# EAGLE design stm32 bord (EAGLE 9.1.0)
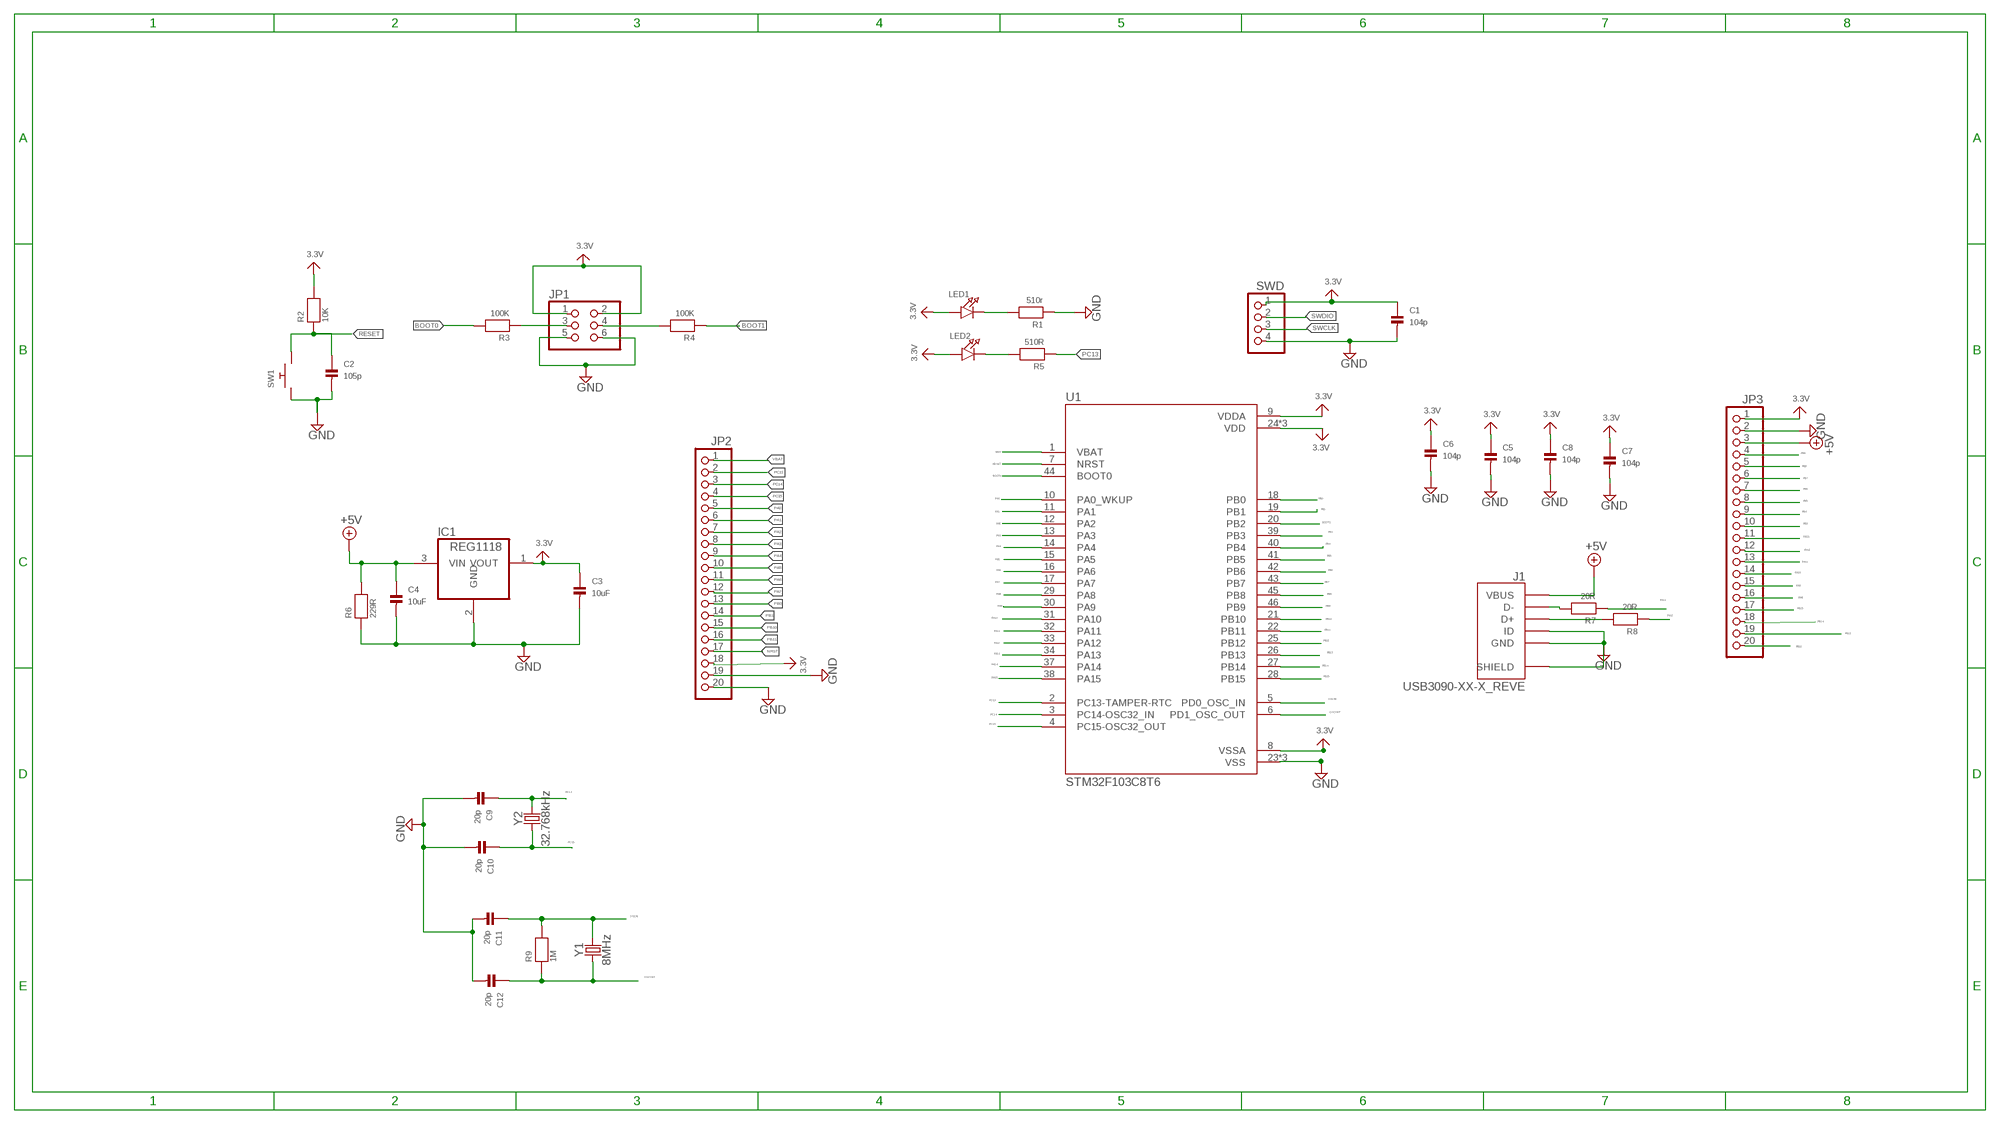
[diagram p0: schematic, sheet 1]

## Parts
C1  104p  CAP_CERAMIC_0603  [_0603]
C2  105p  CAP_CERAMIC_0603  [_0603]
C3  10uF  CAP_CERAMIC_0603  [_0603]
C4  10uF  CAP_CERAMIC_0603  [_0603]
C5  104p  CAP_CERAMIC_0603  [_0603]
C6  104p  CAP_CERAMIC_0603  [_0603]
C7  104p  CAP_CERAMIC_0603  [_0603]
C8  104p  CAP_CERAMIC_0603  [_0603]
C9  20p  CAP_CERAMIC_0603  [_0603]
C10  20p  CAP_CERAMIC_0603  [_0603]
C11  20p  CAP_CERAMIC_0603  [_0603]
C12  20p  CAP_CERAMIC_0603  [_0603]
IC1  REG1118  [SOT223]
J1  USB3090-XX-X_REVE  [GCT_USB3090-XX-X_REVE]
JP1  PINHD-2X3  [2X03]
JP2  PINHD-1X20  [1X20]
JP3  PINHD-1X20  [1X20]
LED1  LED0603  [CHIPLED_0603]
LED2  LED0603  [CHIPLED_0603]
R1  510r  RESISTOR0603  [0603]
R2  10K  RESISTOR0603  [0603]
R3  100K  RESISTOR0603  [0603]
R4  100K  RESISTOR0603  [0603]
R5  510R  RESISTOR0603  [0603]
R6  229R  RESISTOR0603  [0603]
R7  20R  RESISTOR0603  [0603]
R8  20R  RESISTOR0603  [0603]
R9  1M  RESISTOR0603  [0603]
SW1  SWITCH_PUSHBUTTONSOFTTOUCHSMD_SJ  [PUSHBUTTON_SMD_SJ]
SWD  PINHD-1X4  [1X04]
U1  STM32F103C8T6  [QFP50P900X900X160-48N]
Y1  8MHz  CRYSTAL-32.768KHZSMD-2X6  [CRYSTAL-SMD-2X6-CYL]
Y2  32.768kHz  CRYSTAL-32.768KHZSMD-2X6  [CRYSTAL-SMD-2X6-CYL]

## Nets
3.3V: C1.1 C3.1 C5.1 C6.1 C7.1 C8.1 IC1.1(VOUT) JP1.1 JP1.2 JP2.18 JP3.1 LED1.A LED2.A R2.2 SWD.1 U1.8(VSSA) U1.9(VDDA) U1.24(VDD) U1.36(VDD) U1.48(VDD)
+5V: C4.1 IC1.3(VIN) J1.1(VBUS) JP3.3 R6.2
BOOT0: R3.2 U1.44(BOOT0)
BOOT1: R4.1 U1.20(PB2)
GND: C1.2 C2.2 C3.2 C4.2 C5.2 C6.2 C7.2 C8.2 C9.2 C10.2 C11.2 C12.2 IC1.2(GND) J1.4(ID) J1.5(GND) J1.6(SHIELD) J1.7(SHIELD) J1.8(SHIELD) J1.9(SHIELD) JP1.5 JP1.6 JP2.19 JP2.20 JP3.2 R1.1 R6.1 SW1.P$1 SWD.4 U1.23(VSS) U1.35(VSS) U1.47(VSS)
N$1: JP1.3 R3.1
N$2: JP1.4 R4.2
N$3: LED1.C R1.2
N$4: LED2.C R5.2
N$7: J1.2(D-) R7.2
N$8: J1.3(D+) R8.2
NRST: JP2.17
OSCIN: C11.1 R9.2 U1.5(PD0_OSC_IN) Y1.X2
OSCOUT: C12.1 R9.1 U1.6(PD1_OSC_OUT) Y1.X1
PA0: JP2.5 U1.10(PA0_WKUP)
PA1: JP2.6 U1.11(PA1)
PA2: JP2.7 U1.12(PA2)
PA3: JP2.8 U1.13(PA3)
PA4: JP2.9 U1.14(PA4)
PA5: JP2.10 U1.15(PA5)
PA6: JP2.11 U1.16(PA6)
PA7: JP2.12 U1.17(PA7)
PA8: JP3.16 U1.29(PA8)
PA9: JP3.15 U1.30(PA9)
PA10: JP3.14 U1.31(PA10)
PA11: JP3.13 R7.1 U1.32(PA11)
PA12: JP3.12 R8.1 U1.33(PA12)
PA13: U1.34(PA13)
PA14: U1.37(PA14)
PA15: JP3.11 U1.38(PA15)
PB0: JP2.13 U1.18(PB0)
PB1: JP2.14 U1.19(PB1)
PB3: JP3.10 U1.39(PB3)
PB4: JP3.9 U1.40(PB4)
PB5: JP3.8 U1.41(PB5)
PB6: JP3.7 U1.42(PB6)
PB7: JP3.6 U1.43(PB7)
PB8: JP3.5 U1.45(PB8)
PB9: JP3.4 U1.46(PB9)
PB10: JP2.15 U1.21(PB10)
PB11: JP2.16 U1.22(PB11)
PB12: JP3.20 U1.25(PB12)
PB13: JP3.19 U1.26(PB13)
PB14: JP3.18 U1.27(PB14)
PB15: JP3.17 U1.28(PB15)
PC13: JP2.2 R5.1 U1.2(PC13-TAMPER-RTC)
PC14: C9.1 JP2.3 U1.3(PC14-OSC32_IN) Y2.X2
PC15: C10.1 JP2.4 U1.4(PC15-OSC32_OUT) Y2.X1
RESET: C2.1 R2.1 SW1.P$2 U1.7(NRST)
SWCLK: SWD.3
SWDIO: SWD.2
VBAT: JP2.1 U1.1(VBAT)

## Library data of the parts
C1-C12 = microbuilder:CAP_CERAMIC: Ceramic Capacitors 0402 - 0402 Surface Mount Capacitors 16pF 50V 5% [Digikey: 445-4899-2-ND] 18pF 50V 5% [Digikey: 490-1281-2-ND] 22pF 50V 5% [Digikey: 490-1283-2-ND] 68pF 50V 5% [Digikey: 490-1289-2-ND] 0.1uF 10V 10% [Digikey: 490-1318-2-ND] 1.0uF 6.3V 10% [Digikey: 490-1320-2-ND] 0603 - 0603 Surface Mount Capacitors 16 pF 50V 5% [Digikey: 445-5051-2-ND] 22 pF 50V [Digikey: PCC220ACVTR-ND] 33 pF 50V 5% [Digikey: 490-1415-1-ND] 56pF 50V 5% [Digikey: 490-1421-1-ND] 220pF 50V 5% [Digikey: 445-1285-1-ND] 680 pF 50V 2200 pF 50V 5% C0G [Digikey: 445-1297-1-ND] 5600 pF 100V 5% X7R [Digikey: 478-3711-1-ND] 0.1 µF 25V 10% [Digikey: PCC2277TR-ND] 0.22 µF 16V 10% X7R [Digikey: 445-1318-1-ND] 1.0 µF 25V 10% [Digikey: 445-5146-2-ND] 0603 - RF Specific 3pF 250V +/-0.1pF RF [Digikey: 712-1347-1-ND] 18 pF 250V 5% [Digikey: 478-3505-1-ND or 712-1322-1-ND] 56 pF 250V 5% C0G RF [Digikey: 490-4867-1-ND] 68 pF 250V RF [Digikey: 490-4868-1-ND] 0805 - 0805 Surface Mount Capacitors 220 pF 250V 2% RF Ceramic Capacitor [Digikey: 712-1398-1-ND] 1000 pF 50V 2% NP0 Ceramic Capacitor [Digikey: 478-3760-1-ND] 0.1 µF 25V 10% Ceramic Capacitor [Digikey: PCC1828TR-ND] 1.0 µF 16V 10% Ceramic Capacitor[Digikey: 490-1691-2-ND] 10.0 µF 10V 10% Ceramic Capacitor[Digikey: 709-1228-1-ND] 10.0 uF 16V 10% Ceramic Capacitor [Digikey: 478-5165-2-ND] 47 uF 6.3V 20% Ceramic Capacitor [Digikey: 587-1779-1-ND or 399-5506-1-ND] 1206 - 1206 Surface Mount Capacitors 47uF 10V 20% Ceramic Capacitor [Digikey: 490-5528-1-ND or 399-5508-1-ND or 445-6010-1-ND] 100uF 6.3V -20%, +80% Y5V Ceramic Capacitor (Digikey: 490-4512-1-ND, Mouser: 81-GRM31CF50J107ZE1L)
IC1 = burr-brown:REG1118: 800mA Low Dropout (LDO) Positive Regulator with Current Source and Sink Capability; MPN: REG1118-2.85/2K5G4; OC_FARNELL: unknown; OC_NEWARK: 14M2185
J1 = USB3090-XX-X_REVE:USB3090-XX-X_REVE: Micro USB Receptacle, Type AB, SMT, R/A, Bottom Mount, w/out Peg, w/outer shell stakes Check prices <https://pricing.snapeda.com/parts/USB3090-30-A/Global%20Connector%20Technology/view-part?ref=eda>; AVAILABILITY: In Stock; DESCRIPTION: USB - micro AB USB 2.0 Receptacle Connector 5 Position Surface Mount, Right Angle; Through Hole, 2.35mm profile, 5 Pins, Horizontal, Bottom mount; MF: Global Connector Technology; MP: USB3090-30-A; PACKAGE: None; PRICE: None; PURCHASE-URL: https://pricing.snapeda.com/search/part/USB3090-30-A/?ref=eda
JP1 = pinhead:PINHD-2X3: PIN HEADER
JP2 JP3 = pinhead:PINHD-1X20: PIN HEADER
LED1 LED2 = microbuilder:LED: LED 0603 - 0603 Surface Mount Package 2mA: Green LED - Low Power (3.9mcd, 2ma, 1.7Vf) - Digikey: 475-2709-2-ND Orange LED - Low Power (9.8mcd, 2ma, 1.8Vf) - Digikey: 475-1194-2-ND Red LED - Low Power (5mcd, 2ma, 1.8Vf) - Digikey: 475-1195-2-ND Yellow LED - Low Power (7mcd, 2ma, 1.8Vf) - Digikey: 475-1196-2-ND 5mA: Blue LED - Low Power (17mcd, 5ma, 2.9Vf) - Digikey: LNJ937W8CRACT-ND 0805 - 0805 Surface Mount Package 2mA: Red LED (8.8mcd, 2mA, 1.8Vf, Clear) - Low Power [Digikey: 475-2510-1-ND] Green LED (5mcd, 2mA, 1.8Vf, Clear) - Low Power [Digikey: 475-2730-1-ND] Yellow LED (11.3mcd, 2mA, 1.8Vf, Clear) - Low Power [Digikey: 475-2555-1-ND] 20mA: Red LED (104mcd, 20mA, Diffused) - LS R976 [Digikey: 475-1278-6-ND] Red LED (12mcd, 20mA, 2.0Vf, Clear) - APT2012EC [Digikey: 754-1128-1-ND] Green LED (15mcd, 20mA, 2.2Vf, Clear) - APT2012GC [Digikey: 754-1131-1-ND] Orange LED (160mcd, 20mA, 2.1Vf, Clear) - APT2012SECK [Digikey: 754-1130-1-ND] 1206 - 1206 Surface Mount Package Green LED (26mcd, 20mA, Diffused) - LG N971 [Digikey: 475-1407-6-ND] Red LED (15mcd, 20mA, Diffused) - LH N974 [Digikey: 475-1416-6-ND]
R1-R9 = microbuilder:RESISTOR: Resistors 0402 - 0402 Surface Mount Package 22 Ohm 1% 1/16W [Digikey: 311-22.0LRTR-ND] 33 Ohm 5% 1/16W 1.0K 5% 1/16W 1.5K 5% 1/16W 2.0K 1% 1/16W 10.0K 1% 1/16W [Digikey: 311-10.0KLRTR-ND] 10.0K 5% 1/16W [Digikey: RMCF0402JT10K0TR-ND] 12.1K 1% 1/16W [Digikey: 311-22.0LRTR-ND] 100.0K 5% 1/16W 0603 - 0603 Surface Mount Package 0 Ohm 1/10 Watt 1% Resistor 15 Ohm 1/10 Watt 1% Resistor 33 Ohm 1/10 Watt 1% Resistor 49.9 Ohm 1/10 Watt 1% Resistor 100 Ohm 1/10 Watt 1% Resistor 150 Ohm 1/10 Watt 1% Resistor 240 Ohm 1/10 Watt 1% Resistor 390 Ohm 1/10 Watt 1% Resistor 560 Ohm 1/10 Watt 1% Resistor 680 Ohm 1/10 Watt 1% Resistor 750 Ohm 1/10 Watt 1% Resistor 1.0K Ohm 1/10 Watt 1% Resistor 1.5K Ohm 1/10 Watt 1% Resistor 2.0K Ohm 1/10 Watt 1% Resistor 2.2K Ohm 1/10 Watt 1% Resistor 3.3K Ohm 1/10 Watt 1% Resistor 4.7K Ohm 1/10 Watt 1% Resistor 10.0K Ohm 1/10 Watt 1% Resistor 12.0K Ohm 1/10 Watt 1% Resistor 12.1K Ohm 1/10 Watt 1% Resistor 20.0K Ohm 1/10 Watt 1% Resistor 33.0K Ohm 1/10 Watt 1% Resistor 100.0K Ohm 1/10 Watt 1% Resistor 0805 - 0805 Surface Mount Package 0 Ohm 1/8 Watt 1% Resistor 33 Ohm 1/8 Watt 1% Resistor 100 Ohm 1/8 Watt 1% Resistor 150 Ohm 1/8 Watt 1% Resistor 200 Ohm 1/8 Watt 1% Resistor 240 Ohm 1/8 Watt 1% Resistor 330 Ohm 1/8 Watt 1% Resistor 390 Ohm 1/8 Watt 1% Resistor 470 Ohm 1/8 Watt 1% Resistor 1.0K Ohm 1/8 Watt 1% Resistor 1.5K Ohm 1/8 Watt 1% Resistor 2.0K Ohm 1/8 Watt 1% Resistor 4.7K Ohm 1/8 Watt 1% Resistor 5.1K Ohm 1/8 Watt 1% Resistor 5.6K Ohm 1/8 Watt 1% Resistor 10.0K Ohm 1/8 Watt 1% Resistor 22.0K Ohm 1/8 Watt 1% Resistor 33.0K Ohm 1/8 Watt 1% Resistor 100K Ohm 1/8 Watt 1% Resistor 1206 - 1206 Surface Mount Package 2012 - 2010 Surface Mount Package 0.11 Ohm 1/2 Watt 1% Resistor - Digikey: RHM.11UCT-ND
SW1 = microbuilder:SWITCH_PUSHBUTTON: Buttons SOFTTOUCHSMD_SJ - Soft touch temporary push button (Super Junk Akihabara) Compatible with SKPMANE010 [Mouser: 688-SKPMAN]
SWD = pinhead:PINHD-1X4: PIN HEADER
U1 = STM32F103C8T6 (1):STM32F103C8T6: Mainstream Performance line, ARM Cortex-M3 MCU with 64 Kbytes Flash, 72 MHz CPU, motor control, USB and CAN Check prices <https://pricing.snapeda.com/parts/STM32F103C8T6/STMicroelectronics/view-part?ref=eda>; AVAILABILITY: In Stock; DESCRIPTION: ARM® Cortex®-M3 STM32F1 Microcontroller IC 32-Bit 72MHz 64KB (64K x 8) FLASH 48-LQFP (7x7); MF: STMicroelectronics; MP: STM32F103C8T6; PACKAGE: LQFP-48 STMicroelectronics; PRICE: None; PURCHASE-URL: https://pricing.snapeda.com/search/part/STM32F103C8T6/?ref=eda
Y1 = SparkFun-Clocks:CRYSTAL-32.768KHZ: 32.768kHz Crystal Frequency: 32.768kHz Frequency Stability: ±20ppm Load Capacitance: 12.5pF (PTH-2X6 & SMD-3.2X1.5), 6pF (SMD-2X6) SparkFun Products: SparkFun BigTime Watch Kit <https://www.sparkfun.com/products/11734> SparkFun nRF52832 Breakout <https://www.sparkfun.com/products/13990> SparkFun Real Time Clock Module <https://www.sparkfun.com/products/12708>; PROD_ID: XTAL-07894; VALUE: 32.768kHz
Y2 = SparkFun-Clocks:CRYSTAL-32.768KHZ: 32.768kHz Crystal Frequency: 32.768kHz Frequency Stability: ±20ppm Load Capacitance: 12.5pF (PTH-2X6 & SMD-3.2X1.5), 6pF (SMD-2X6) SparkFun Products: SparkFun BigTime Watch Kit <https://www.sparkfun.com/products/11734> SparkFun nRF52832 Breakout <https://www.sparkfun.com/products/13990> SparkFun Real Time Clock Module <https://www.sparkfun.com/products/12708>; PROD_ID: XTAL-07894

## Net classes
0 default: width 0.254 mm, drill 0.254 mm, clearance 0.203 mm
1 5V: width 0.254 mm, drill 0.254 mm, clearance 0.203 mm
2 3V3: width 0.254 mm, drill 0.254 mm, clearance 0.203 mm

## Board
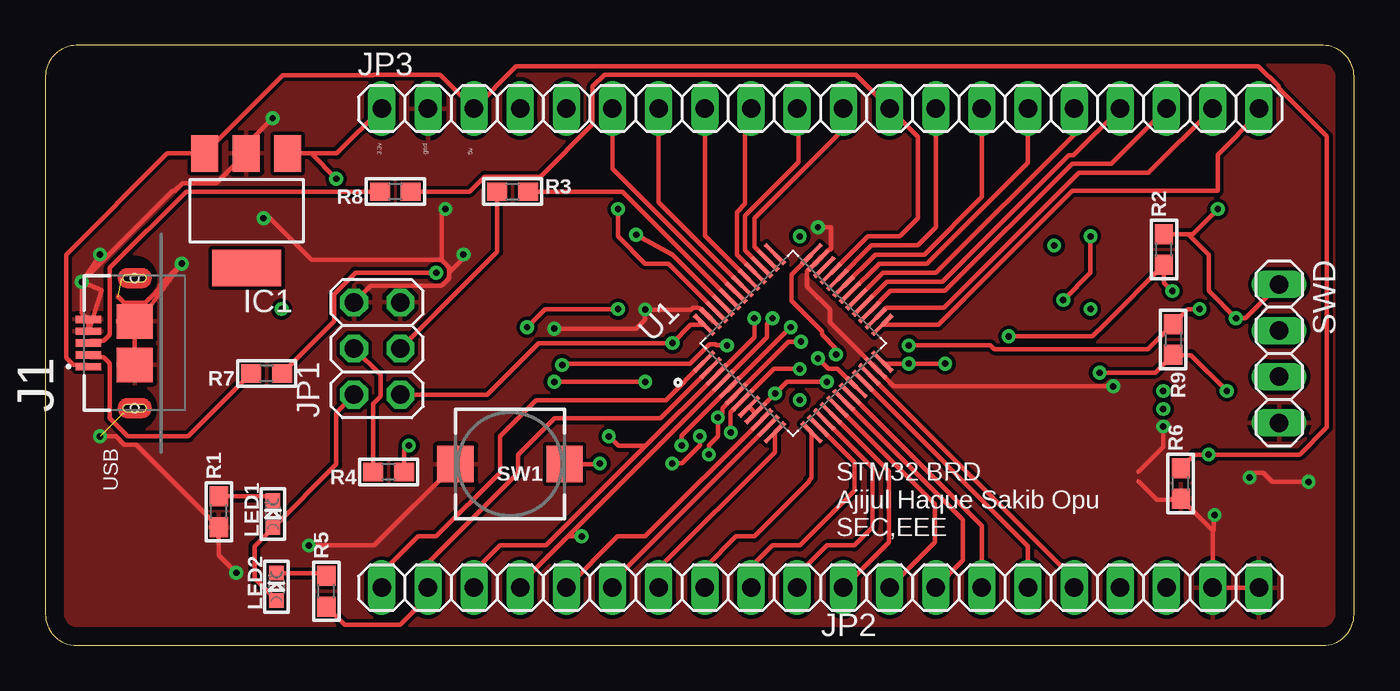
[diagram p1: board, top side]
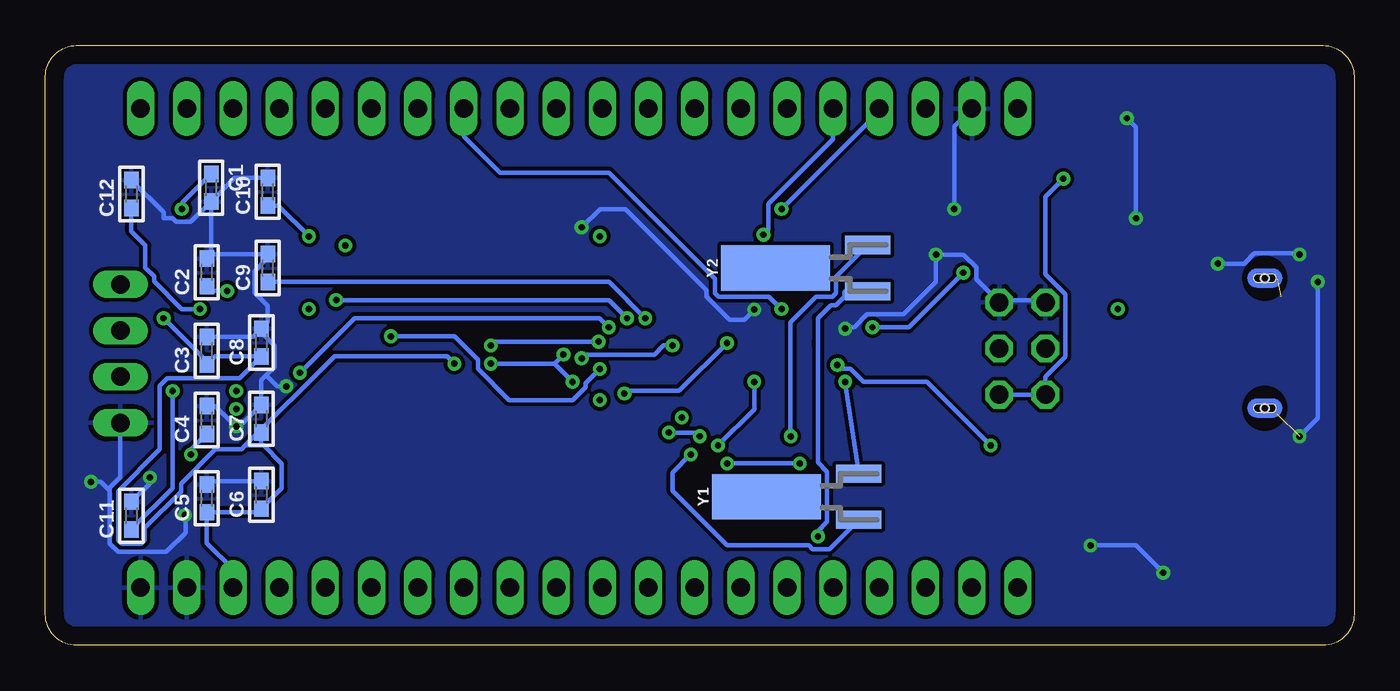
[diagram p2: board, bottom side, seen from below]

Size 72 x 33 mm. Coordinates in mm from the lower left corner, seen from the top.
Outline: 0,31.29 0,1.71 arc90 1.71,0 70.29,0 arc90 72,1.71 72,31.29 arc90 70.29,33 1.71,33 arc90 0,31.29
Copper layers (1*16): Top 0.035mm / dielectric 1.5mm / Bottom 0.035mm
Design rules "default *": minimum track width 6mil, minimum drill 0.35mm, track to track 6mil, track to pad 6mil, pad to pad 6mil, via to via 6mil, smd to smd 6mil, copper to edge 40mil, drill to drill 6mil, minimum pad ring 10mil, minimum via ring 8mil, stop-mask expansion 4mil, vias tented up to drill 0mil, thermal gap 10mil

### Footprints (pad centres in the part's own frame; a part is rotated, then mirrored left to right if it is on the bottom)
_0603 = smd 0.9 x 0.8: 1 -0.762,0; 2 0.762,0
SOT223 = smd 1.499 x 2.007: 1 -2.261,-3.15; 2 0.025,-3.15; 3 2.311,-3.15 | smd 3.81 x 2.007: 4 0,3.15
GCT_USB3090-XX-X_REVE = smd 0.4 x 1.4: 1 -1.3,2.55; 2 -0.65,2.55; 3 0,2.55; 4 0.65,2.55; 5 1.3,2.55 | smd 0.1 x 0.1: 6 -3.87,0.63; 7 3.51,0.72 | smd 1.9 x 2: 8 -1.2,0; 9 1.2,0 | hole 0.45: -3.575,0; 3.575,0
2X03 = drill 1.016 octagon: 1 -2.54,-1.27; 2 -2.54,1.27; 3 0,-1.27; 4 0,1.27; 5 2.54,-1.27; 6 2.54,1.27
1X20 = drill 1.016 long: 1 -24.13,0; 2 -21.59,0; 3 -19.05,0; 4 -16.51,0; 5 -13.97,0; 6 -11.43,0; 7 -8.89,0; 8 -6.35,0; 9 -3.81,0; 10 -1.27,0; 11 1.27,0; 12 3.81,0; 13 6.35,0; 14 8.89,0; 15 11.43,0; 16 13.97,0; 17 16.51,0; 18 19.05,0; 19 21.59,0; 20 24.13,0
CHIPLED_0603 = smd 0.8 x 0.8: A 0,-0.75; C 0,0.75
0603 = smd 1.1 x 1: 1 -0.85,0; 2 0.85,0
PUSHBUTTON_SMD_SJ = smd 2 x 2: P$1 3,0; P$2 -3,0
1X04 = drill 1.016 long: 1 -3.81,0; 2 -1.27,0; 3 1.27,0; 4 3.81,0
QFP50P900X900X160-48N = smd 1.56 x 0.28: 1 -4.18,2.75; 2 -4.18,2.25; 3 -4.18,1.75; 4 -4.18,1.25; 5 -4.18,0.75; 6 -4.18,0.25; 7 -4.18,-0.25; 8 -4.18,-0.75; 9 -4.18,-1.25; 10 -4.18,-1.75; 11 -4.18,-2.25; 12 -4.18,-2.75; 25 4.18,-2.75; 26 4.18,-2.25; 27 4.18,-1.75; 28 4.18,-1.25; 29 4.18,-0.75; 30 4.18,-0.25; 31 4.18,0.25; 32 4.18,0.75; 33 4.18,1.25; 34 4.18,1.75; 35 4.18,2.25; 36 4.18,2.75 | smd 0.28 x 1.56: 13 -2.75,-4.18; 14 -2.25,-4.18; 15 -1.75,-4.18; 16 -1.25,-4.18; 17 -0.75,-4.18; 18 -0.25,-4.18; 19 0.25,-4.18; 20 0.75,-4.18; 21 1.25,-4.18; 22 1.75,-4.18; 23 2.25,-4.18; 24 2.75,-4.18; 37 2.75,4.18; 38 2.25,4.18; 39 1.75,4.18; 40 1.25,4.18; 41 0.75,4.18; 42 0.25,4.18; 43 -0.25,4.18; 44 -0.75,4.18; 45 -1.25,4.18; 46 -1.75,4.18; 47 -2.25,4.18; 48 -2.75,4.18
CRYSTAL-SMD-2X6-CYL = smd 2.5 x 6: SHEILD 0,5.08 | smd 1 x 2.5: X1 -1.27,0; X2 1.27,0

### Placement (x,y rotation side)
C1  62.88,25.17 270 bottom
C2  63.12,20.52 90 bottom
C3  63.12,16.21 90 bottom
C4  63.12,12.4 90 bottom
C5  63.12,8.09 90 bottom
C6  60.12,8.28 90 bottom
C7  60.12,12.47 90 bottom
C8  60.12,16.66 90 bottom
C9  59.77,20.76 90 bottom
C10  59.77,24.95 90 bottom
C11  67.27,7.14 90 bottom
C12  67.27,24.83 90 bottom
IC1  11.07,23.91 180 top
J1  4.91,16.63 90 top
JP1  18.25,16.33 90 top
JP2  42.63,3.18 0 top
JP3  42.63,29.53 0 top
LED1  12.52,7.23 0 top
LED2  12.71,3.23 0 top
R1  9.54,7.36 90 top
R2  61.54,21.78 90 top
R3  25.7,24.96 0 top
R4  18.88,9.54 180 top
R5  15.46,2.99 90 top
R6  62.46,8.91 90 top
R7  12.17,14.96 180 top
R8  19.25,24.96 180 top
R9  62.04,16.83 270 top
SW1  25.56,9.98 180 top
SWD  67.88,16.05 270 top
U1  41.14,16.62 45 top
Y1  27.25,8.18 90 bottom
Y2  26.75,20.76 90 bottom

### Tracks (layer width: path | path; a pad name or v marks a point on that pad's centre or on a via)
3.3V  (via drill 0.35)
  Top 0.254: JP1.1 24.29,13.79 27.13,16.63 v34.5,16.63 35.5,17.63 U1.48 | JP1.2 16,12.81 16,9.96 LED1.A 11.5,5.46 11.5,3.69 LED2.A | JP3.1 16.03,27.06 IC1.1 14.61,27.06 v16,25.67 | U1.8 U1.9 v40.14,13.86 40.79,14.5 v43,14.5 | U1.24 46.15,15.5 v47.5,15.5 v49.5,15.5 | SWD.1 66.02,18 v65.5,18 64,19.5 64,21.5 62.87,22.63 R2.2 63.13,22.63 v64.5,24 | U1.36 42.15,21.48 41.05,20.38 41.05,18.95 42.71,17.29 42.71,17.11 43.5,16.32 v43.5,16
  Bottom 0.254: JP2.18 61.68,4.18 63.12,5.62 C5.1 60.31,7.33 C6.1 59,8.64 59,10 60,11 | 60,11 60.12,11.12 C7.1 | v16,25.67 16.98,24.69 16.98,20.41 15.89,19.32 15.89,15.88 16.98,14.79 JP1.2 JP1.1 | v43,14.5 44,15.5 | v47.5,15.5 44,15.5 | v65.5,18 63.12,15.62 C3.1 62.67,15.9 C8.1 61.31,14.71 65.29,14.71 65.71,14.29 65.71,10.78 68,8.49 68,5.79 67.81,5.6 66.73,5.6 66.54,5.79 66.54,6.46 64.54,8.46 64.54,8.9 62.65,10.79 61.21,10.79 61,11 | C1.1 64.5,24.31 v64.5,24 | v34.5,16.63 37.13,14 40,14 v40.14,13.86 | v49.5,15.5 49.9,15.9 56.1,15.9 61,11 | 61,11 60,11 | v43.5,16 44,15.5
+5V  (via drill 0.35)
  Top 0.254: R6.2 63.2,10.5 v64,10.5 69,10.5 70.5,12 70.5,28 67.85,30.65 67.85,30.74 66.74,31.86 25.91,31.86 JP3.3 21.73,31.38 18.05,31.38 18.02,31.36 13.06,31.36 IC1.3 6.7,27.06 1.14,21.5 1.14,15.83 1.52,15.45 2.24,15.45 J1.1
  Bottom 0.254: C4.1 64,10.76 v64,10.5
BOOT0
  Top 0.254: U1.44 31.74,24.96 R3.2
BOOT1  (via drill 0.35)
  Top 0.254: R4.1 19.73,10.73 v20,11 | v28.43,15.43 28.5,15.5 35.47,15.5 36.53,16.56 36.86,16.56 36.92,16.5 v37.5,16.5 | v42.5,15.79 43.08,15.21 43.57,15.21 44.58,14.2 U1.20
  Bottom 0.254: v20,11 23.5,14.5 27,14.5 27.71,15.21 28.21,15.21 v28.43,15.43 | v42.5,15.79 42.29,16 38.5,16 38,16.5 v37.5,16.5
GND  (via drill 0.35, 0.35 pad 0.55)  (2 unrouted)
  Top 0.254: v2,20 2,18.29 J1.5 J1.4 | v2,20 5.29,23.29 5.71,23.71 7,25 7.12,25 7.54,25.42 9.4,25.42 IC1.2 11.04,27.55 v12.5,29 | v12,23.5 12.35,23.5 14.64,21.21 21.79,21.21 | 22.21,20.5 22.21,20.21 21.79,19.79 17.9,19.79 JP1.6 | 22.21,20.5 22.21,20.79 21.79,21.21 | 21.79,21.21 21.79,23.79 v22,24 | SW1.P$1 18.08,5.5 v14.5,5.5 | v10.5,4 9.54,4.96 R1.1 5.01,11.04 4.34,11.04 3.88,11.5 v3,11.5 | v58.75,14.25 46.69,14.25 U1.23 43.17,17.77 43.17,18.48 41.91,19.74 41.91,20.57 U1.35 43.13,21.79 43.21,21.79 43.21,23 v42.51,23 v42.5,23 | JP2.20 JP2.19 64.22,6.3 | 64.22,6.3 62.51,8.01 | 64.22,6.3 64.29,6.37 64.29,6.79 64.32,6.82 v64.32,7.18 | v69.5,9 67.5,9 67,9.5 66.5,9.5 v66.24,9.24 | C6.2 61.15,8.01 62.51,8.01 | v61.5,12.04 61.5,10.92 60.12,9.54 | R6.1 62.51,8.01 | 22.21,20.5 23,21.29 v23,21.5 | v28,17.42 32.5,17.42 33,17.92 v33,18.47 35.51,18.47 35.62,18.58 35.95,18.58 36.55,17.98 U1.47 | J1.8 4.91,17.5 | 4.91,17.5 J1.9 4.91,18.27 4.34,18.84 | v2,20 3.08,19.53 2.35,17.21 | v2,20 v3,21.5 | 4.91,17.5 v7.5,21 6.28,19.78 6.28,19.64 5.48,18.84 4.34,18.84 | 4.34,18.84 4,19.18
  Bottom 0.254: 16.5,19 19.39,19 JP1.5 20.79,20.14 20.79,20.79 21.5,21.5 v23,21.5 23,20 24.79,18.21 26.79,18.21 27.5,17.5 28,17.5 v28,17.42 | v3,11.5 2,12.5 v2,20 | v12,23.5 12,28.5 v12.5,29 | v22,24 22,28.57 JP3.2 | v14.5,5.5 12,5.5 v10.5,4 | 62.88,21.52 C1.2 | C1.2 64,23.29 64.79,23.29 65,23.5 65.5,23.5 65.5,23.82 C12.2 | C1.2 61.58,25.71 C10.2 | 62.88,21.52 C9.2 59.77,21.32 60.5,20.59 60.5,19.41 59.77,18.68 59.77,17.77 C8.2 | 62.88,21.52 C2.2 | C3.2 60.57,16.97 C8.2 | C4.2 62.66,13.16 61.79,12.29 61.06,12.29 | 61.06,12.29 C7.2 60.12,14.58 59.85,14.85 | C8.2 60.12,17.21 59.39,16.48 59.39,15.31 59.85,14.85 | 59.85,14.85 59.25,14.25 v58.75,14.25 | 68.46,8.5 68.46,5.6 68,5.14 65.36,5.14 64.29,6.21 64.29,6.79 64.32,6.82 v64.32,7.18 | 68.46,8.5 68.46,8.68 67.88,9.26 SWD.4 | 68.46,8.5 68.96,9 v69.5,9 | v66.24,9.24 66.24,8.93 C11.2 | 61.06,12.29 61.31,12.04 v61.5,12.04 | v42.5,23 41.5,24 40.08,24 35.62,19.54 35.62,19.18 34.36,17.92 33.55,17.92 v33,18.47 | C5.2 62.93,9.04 C6.2 | v7.5,21 6.05,21 5.48,21.57 3.07,21.57 v3,21.5
  pour Top: -1.5,34.5 74,34.5 74,-2.5 -2,-2
  pour Bottom: -2,-2 -1.5,34.5 74,34.5 74,-2.5
N$1
  Top 0.254: JP1.3 24.85,21.66 R3.1
N$2
  Top 0.254: R4.2 18.03,13.29 18.43,13.69 18.43,14.88 JP1.4
N$3
  Top 0.254: R1.2 12.29,8.21 LED1.C
N$4
  Top 0.254: LED2.C 15.32,3.98 R5.2
N$7
  Top 0.254: J1.2 2.48,15.86 3.2,15.86 3.54,15.52 3.54,12.49 4.53,11.5 7.86,11.5 R7.2
N$8
  Top 0.254: J1.3 2.48,16.75 3.2,16.75 3.54,17.09 3.54,20.77 7.73,24.96 R8.2
N$16  (via drill 0.35)
  other vias: 55.5,22
N$17  (via drill 0.35)
  other vias: 57.5,18.5
N$23  (via drill 0.35)
  other vias: 13,18.5
N$31  (via drill 0.35)
  other vias: 41.5,22.5
N$34  (via drill 0.35)
  other vias: 41.5,13.5
N$36  (via drill 0.35)
  other vias: 61.5,13
N$37  (via drill 0.35)
  other vias: 61.5,14
OSCIN  (via drill 0.35)
  Top 0.254: v28,14.5 v33,14.5 | v35,11 35,11.54 37.48,14.02 | v58,15 61.06,15 R9.2 | R9.2 | v65,14 63.03,15.97 R9.2 | 40.96,17.5 v41,17.5 38.3,14.79 38.29,14.79 37.52,14.02 37.48,14.02 | 37.48,14.02 U1.5
  Bottom 0.254: Y1.X2 v28,14.5 | v35,11 33,13 v33,14.5 | v58,15 55,18 41.5,18 v41,17.5 | C11.1 65,8.65 v65,14
OSCOUT  (via drill 0.35, 0.35 pad 0.55)
  Top 0.254: v36.5,10.5 36.5,11 37,11.5 v37,12.54 37.25,12.79 37.25,13.04 38.01,13.8 U1.6 40.88,16.71 v41.57,16.71 | v63.5,18.5 62.86,18.5 R9.1 60.65,16.29 52.21,16.29 52,16.5 v47.5,16.5
  Bottom 0.254: Y1.X1 28.87,5.29 29.79,5.29 30,5.5 34.5,5.5 37.5,8.5 37.5,9.5 v36.5,10.5 | v63.5,18.5 64.5,18.5 66.03,20.03 66.03,20.31 66.5,20.79 66.5,22 67.27,22.77 C12.1 | v41.57,16.71 47.29,16.71 v47.5,16.5
PA0
  Top 0.254: U1.10 32.99,6 31.48,6 JP2.5
PA1
  Top 0.254: U1.11 31.2,3.5 JP2.6
PA2
  Top 0.254: U1.12 40.13,10.63 33.74,4.24 JP2.7
PA3
  Top 0.254: JP2.8 36.28,4.28 38,6 39,6 42,9 42,9.07 42.15,9.22 U1.13
PA4
  Top 0.254: U1.14 44.5,10.08 44.5,8.5 41.5,5.5 40,5.5 38.82,4.32 JP2.9
PA5
  Top 0.254: U1.15 45.5,9.79 45.5,6.5 44.5,5.5 43,5.5 41.36,3.86 JP2.10
PA6
  Top 0.254: U1.16 46.4,9.59 46.4,5.68 JP2.11
PA7
  Top 0.254: U1.17 48.94,7.76 48.94,5.68 JP2.12
PA8
  Top 0.254: U1.29 46.08,20.5 49,20.5 56.6,28.1 JP3.16
PA9
  Top 0.254: U1.30 45.87,21 48.5,21 54.06,26.56 JP3.15
PA10
  Top 0.254: U1.31 45.67,21.5 48.35,21.5 51.52,24.67 JP3.14
PA11  (via drill 0.35)
  Top 0.254: U1.32 45.46,22 48,22 49,23 49,29.51 JP3.13 | R7.1 15.89,17.83 15.89,19.32 17.07,20.5 v21.5,20.5 | v26.5,17.5 27.5,18.5 v31.5,18.5
  Bottom 0.254: v21.5,20.5 24.5,17.5 v26.5,17.5 | JP3.13 48.98,27.98 47,26 41,26 35.16,20.16 35.16,19.37 34.97,19.18 32.18,19.18 31.75,18.75 v31.5,18.5
PA12
  Top 0.254: U1.33 45.25,22.5 47,22.5 48,23.5 48,27.97 46.48,29.48 | 46.48,29.48 JP3.12 | R8.1 23.33,24.96 24.16,25.79 27.24,25.79 30.11,28.66 30.11,30.74 30.75,31.38 44.59,31.38 46.48,29.48 | 46.48,29.52 46.48,29.48
PA15
  Top 0.254: U1.38 39,21.94 39,23.5 43.9,28.4 JP3.11
PB0
  Top 0.254: U1.18 50.48,6.93 50.48,4.68 JP2.13
PB1
  Top 0.254: U1.19 51.52,6.59 JP2.14
PB3
  Top 0.254: U1.39 38.5,21.73 38.5,23.65 41.43,26.57 41.43,29.46 JP3.10
PB4
  Top 0.254: U1.40 38.04,21.48 38.04,23.84 38.5,24.29 38.5,29.21 JP3.9
PB5
  Top 0.254: U1.41 36.28,22.54 JP3.8
PB6
  Top 0.254: U1.42 33.74,24.37 JP3.7
PB7
  Top 0.254: U1.43 31.2,26.21 JP3.6
PB8  (via drill 0.35)
  Top 0.254: U1.45 34.5,21.49 | 34.5,21.49 34.5,21.5 | 34.5,21.49 v32.5,22.59
  Bottom 0.254: v32.5,22.59 32.21,22.88 32.21,24.29 28.66,27.84 JP3.5
PB9  (via drill 0.35)
  Top 0.254: U1.46 34.28,21 33,21 31.5,22.5 v31.5,24
  Bottom 0.254: v31.5,24 26.12,29.38 JP3.4
PB10
  Top 0.254: U1.21 54.06,5.47 JP2.15
PB11
  Top 0.254: U1.22 56.6,3.63 JP2.16
PB12
  Top 0.254: U1.25 49.13,17.63 56.5,25 64.5,25 64.5,27 66.76,29.26 JP3.20
PB13
  Top 0.254: JP3.19 60.69,26 56.85,26 49.44,18.58 46.28,18.58 U1.26
PB14
  Top 0.254: U1.27 46.49,19.5 49.5,19.5 56.5,26.5 58.5,26.5 58.65,26.5 JP3.18
PB15
  Top 0.254: U1.28 46.29,20 49.35,20 55.93,26.57 56,26.65 56.31,26.96 56.5,26.96 56.57,26.96 JP3.17
PC13
  Top 0.254: JP2.2 21.04,3.5 | 21.04,3.5 21.04,4.54 26,9.5 26,10.5 28,12.5 33.84,12.5 U1.2 | R5.1 16.46,1.14 19.5,1.14 21.04,2.68 21.04,3.5
PC14  (via drill 0.35)
  Top 0.254: 33.02,10.98 U1.3 39,16.95 v39,18 | 33.02,10.98 27.55,5.5 25,5.5 23.58,4.08 JP2.3 | v31,11.5 31.52,10.98 33.02,10.98
  Bottom 0.254: v31,11.5 31,17.78 29.6,19.18 28.69,19.18 28.5,19.37 28.5,20.28 Y2.X2 | v39,18 41,20 C9.1
PC15  (via drill 0.35)
  Top 0.254: 26.12,3.37 U1.4 39.71,16.96 39.71,17.71 v40,18 | 26.12,3.37 JP2.4 | v29.5,6 28.75,6 26.12,3.37 | v56,19 57.5,20.5 v57.5,22.5
  Bottom 0.254: 29.5,16.74 29.5,16.5 | 29.5,16.5 29.5,10.07 29,9.57 29,6.79 29.5,6.29 v29.5,6 | v40,18 41,19 v56,19 | v57.5,22.5 59.19,24.19 C10.1 | Y2.X1 28.01,19.49 28.04,19.46 28.04,19.18 28.5,18.72 28.78,18.72 29.5,18 29.5,16.5
RESET  (via drill 0.35)
  Top 0.254: SW1.P$2 30.47,9.98 v30.5,10.01 | v34.49,10.01 35.01,10.01 35.79,10.79 35.79,10.8 36,11.01 v36,11.5 | v37.7,11.71 37.7,12.83 U1.7 40.08,15.21 v41.5,15.21 | v53,17 57.61,17 58.3,17.7 R2.1 61.54,19.96 v62,19.5
  Bottom 0.254: v30.5,10.01 v34.49,10.01 v34.5,10 | v36,11.5 36.2,11.71 v37.7,11.71 | v62,19.5 62.86,19.5 C2.1 | v41.5,15.21 42.29,14.42 42.29,14.21 43,13.5 46.5,13.5 48.21,15.21 48.21,15.71 49.5,17 v53,17
VBAT
  Top 0.254: U1.1 34.13,13.5 27,13.5 25,11.5 25,9.5 21.5,6 20.5,6 18.5,4 JP2.1

### Text on the board
tPlace: 3.3v | gnd | 5v | USB | STM32 BRD / Ajijul Haque Sakib Opu / SEC,EEE